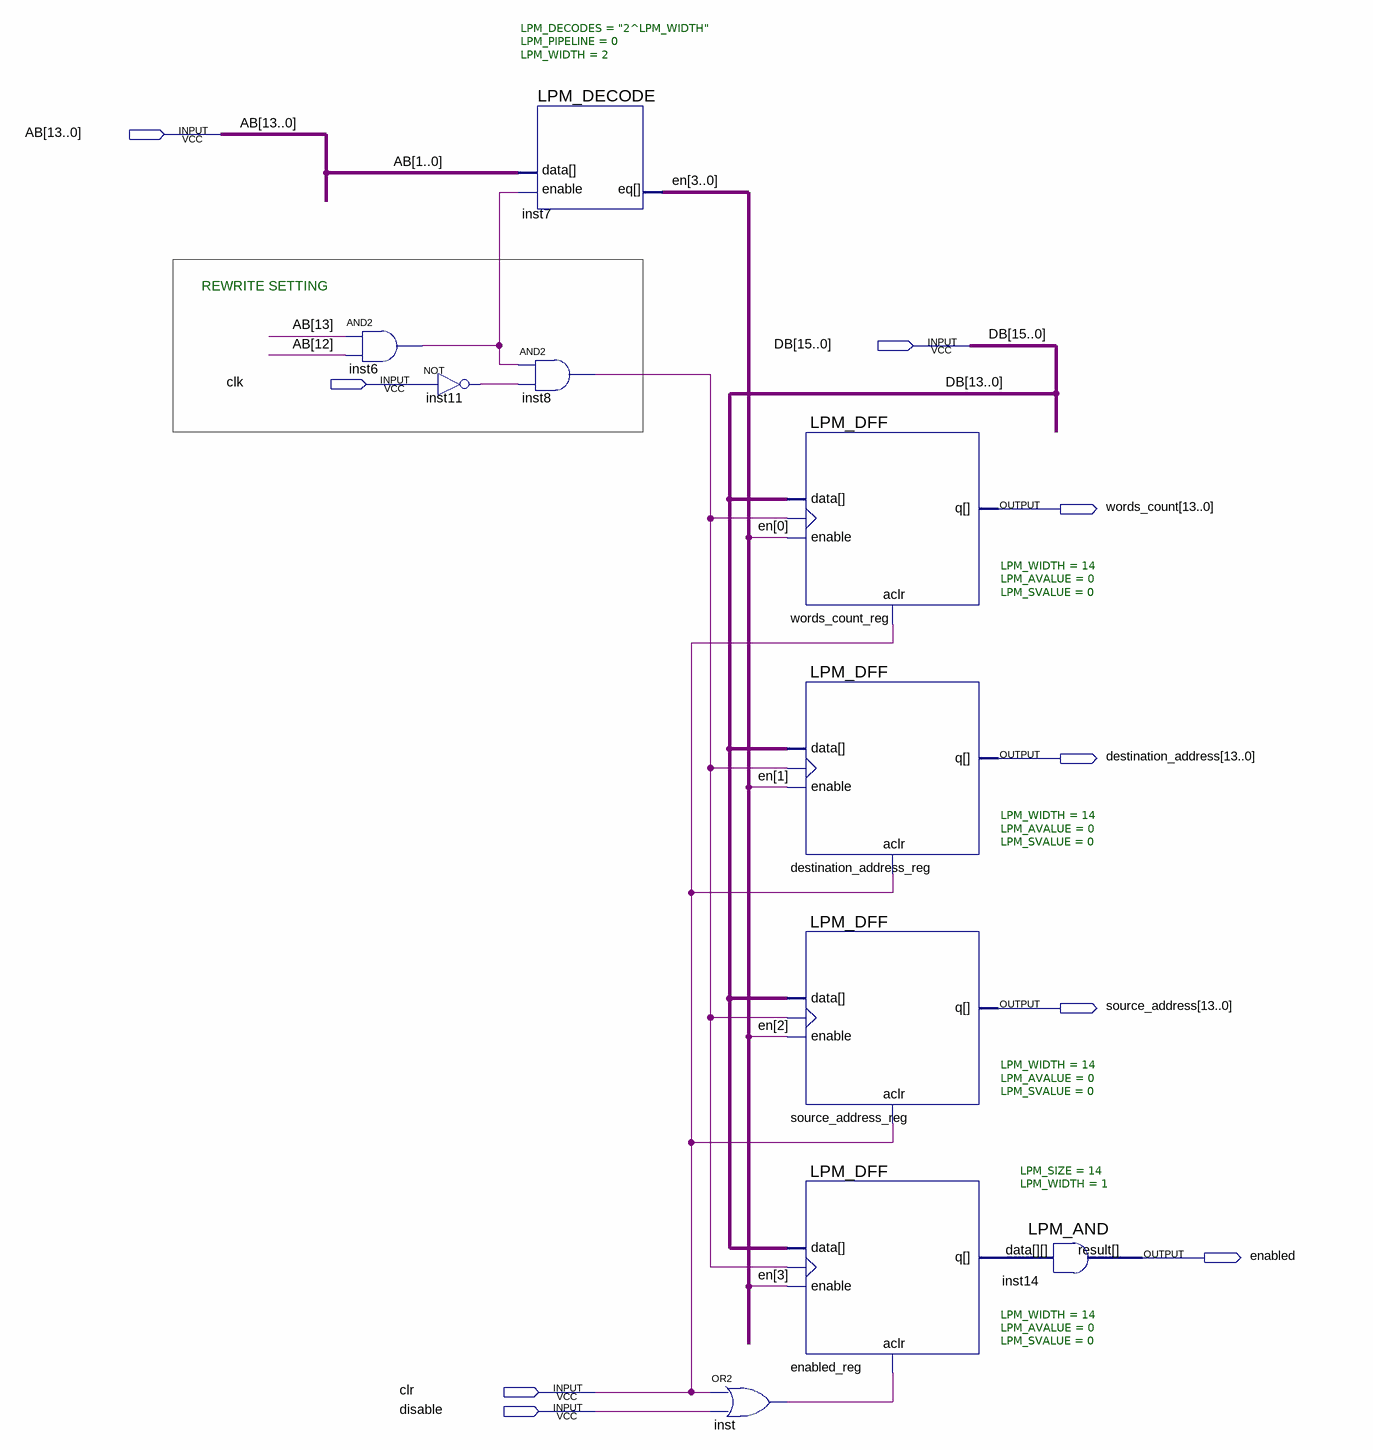
[diagram p0: schematic sheet]
// Quartus schematic DMA_settings.bdf as structural Verilog: 10 symbols, 9 pins
module DMA_settings (
  input  [13:0] AB,
  input  [15:0] DB,
  input  clk,
  input  clr,
  input  \disable ,
  output [13:0] words_count,
  output [13:0] destination_address,
  output [13:0] source_address,
  output enabled
);

  wire inst6_out, inst8_out, inst11_out, inst_out;
  wire [3:0] en;
  wire [13:0] enabled_reg_q;

  and inst6 (inst6_out, AB[13], AB[12]);
  not inst11 (inst11_out, clk);
  LPM_DECODE #(.LPM_DECODES("2^LPM_WIDTH"), .LPM_PIPELINE(0), .LPM_WIDTH(2)) inst7 (
    .enable(inst6_out), .data(AB[1:0]), .eq(en));
  and inst8 (inst8_out, inst6_out, inst11_out);
  or inst (inst_out, clr, \disable );
  LPM_DFF #(.LPM_WIDTH(14), .LPM_AVALUE(0), .LPM_SVALUE(0)) words_count_reg (
    .enable(en[0]), .clock(inst8_out), .data(DB[13:0]), .aclr(clr), .q(words_count));
  LPM_DFF #(.LPM_WIDTH(14), .LPM_AVALUE(0), .LPM_SVALUE(0)) destination_address_reg (
    .enable(en[1]), .clock(inst8_out), .data(DB[13:0]), .aclr(clr), .q(destination_address));
  LPM_DFF #(.LPM_WIDTH(14), .LPM_AVALUE(0), .LPM_SVALUE(0)) source_address_reg (
    .enable(en[2]), .clock(inst8_out), .data(DB[13:0]), .aclr(clr), .q(source_address));
  LPM_DFF #(.LPM_WIDTH(14), .LPM_AVALUE(0), .LPM_SVALUE(0)) enabled_reg (
    .enable(en[3]), .clock(inst8_out), .data(DB[13:0]), .aclr(inst_out), .q(enabled_reg_q));
  LPM_AND #(.LPM_SIZE(14), .LPM_WIDTH(1)) inst14 (.data(enabled_reg_q), .result(enabled));

  // Notes on the sheet:
  //   REWRITE SETTING
endmodule
